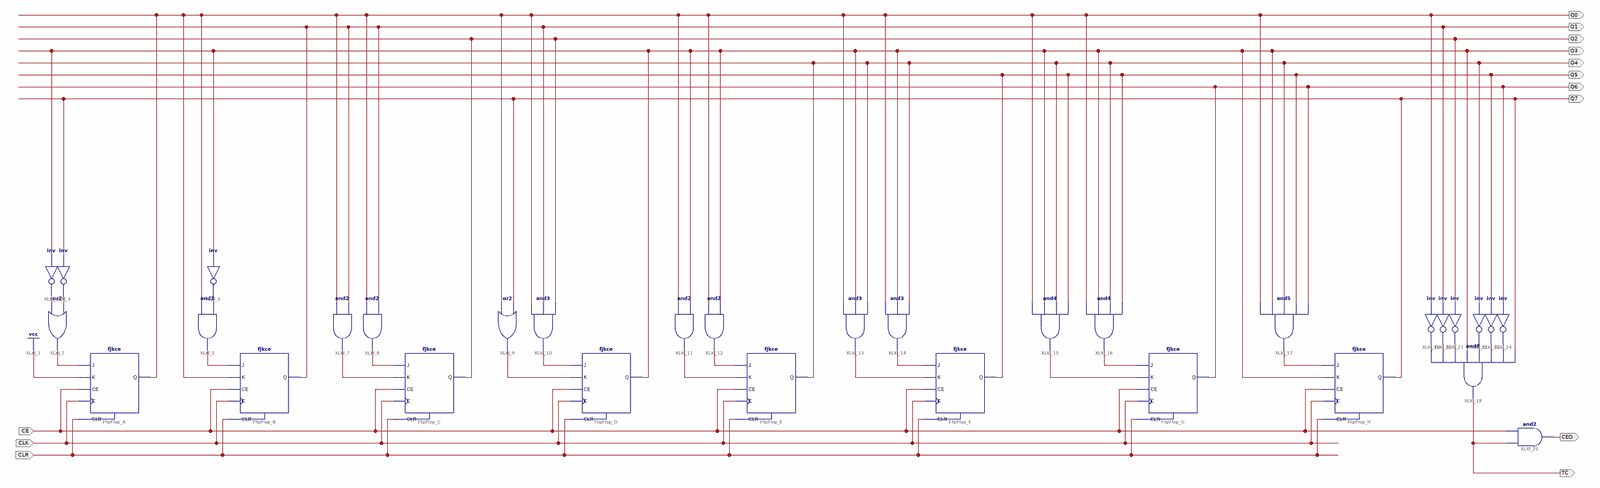
[diagram p0: schematic sheet 1, whole]
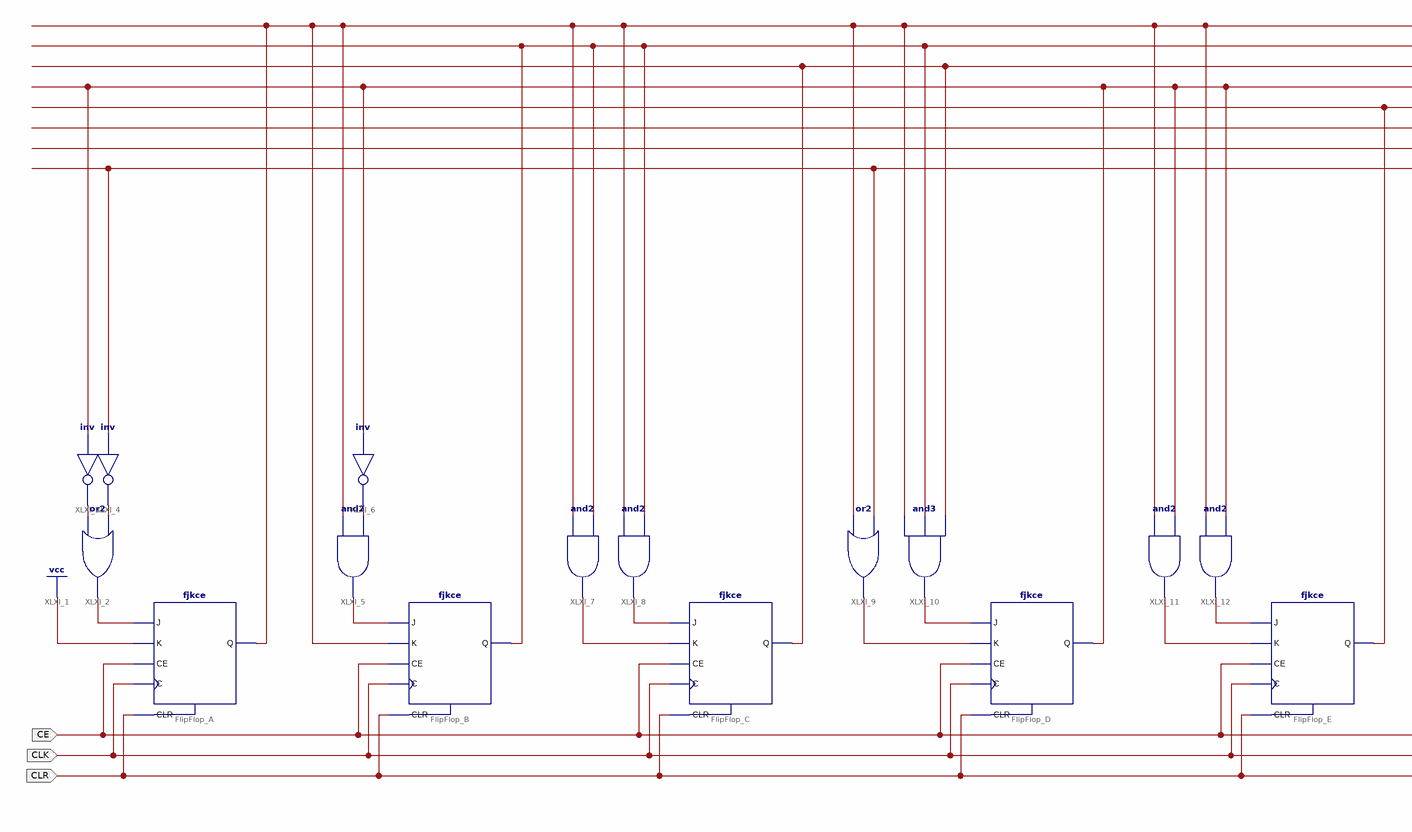
[diagram p1: schematic sheet 1, left part]
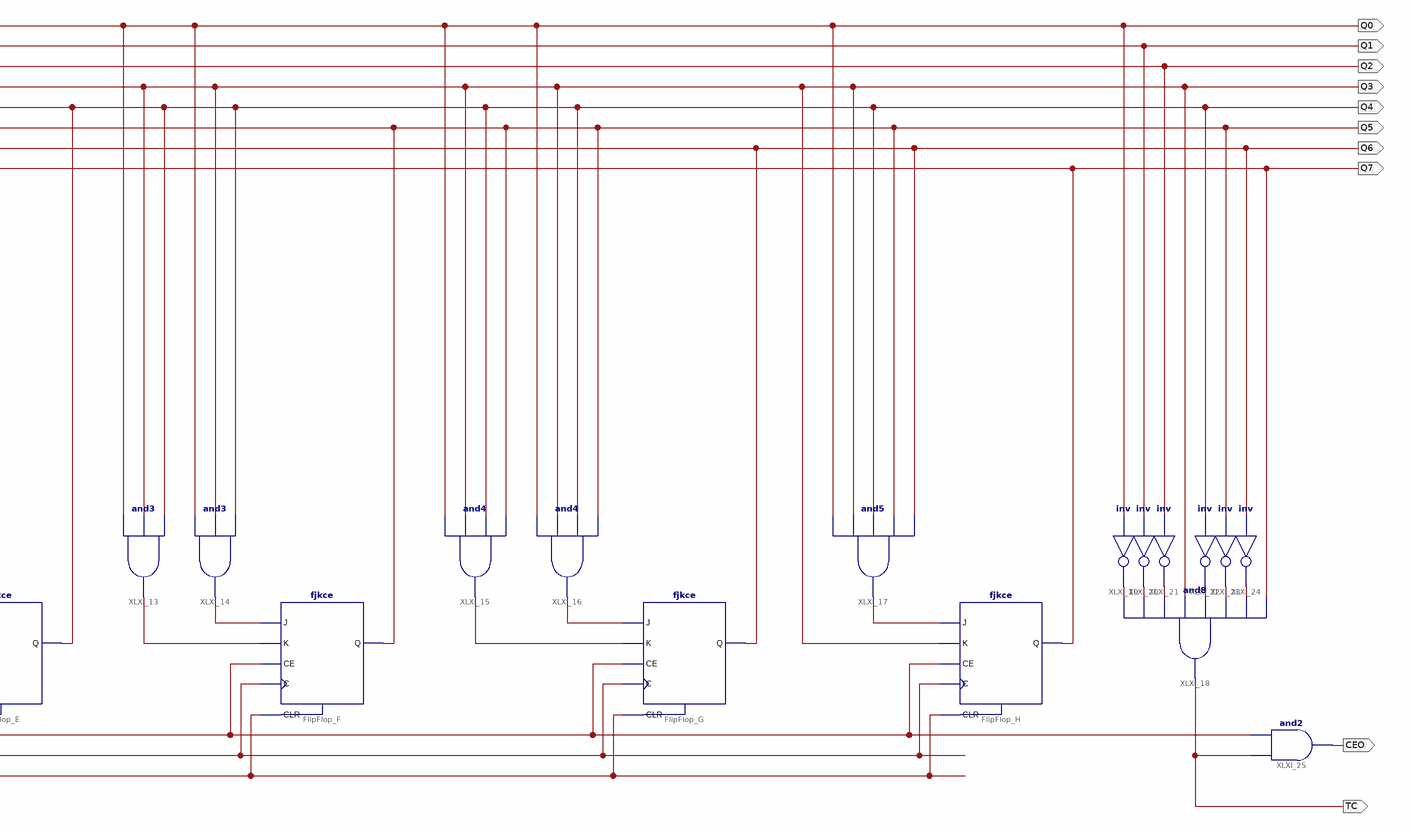
[diagram p2: schematic sheet 1, right part]
// Xilinx ISE schematic counter88.sch (spartan6) as structural Verilog: 32 symbols, 13 ports
module counter88 (
  input  CE,
  input  CLK,
  input  CLR,
  output CEO,
  output TC,
  output Q0,
  output Q1,
  output Q2,
  output Q3,
  output Q4,
  output Q5,
  output Q6,
  output Q7
);

  wire XLXN_2, XLXN_3, XLXN_4, XLXN_5, XLXN_6, XLXN_7, XLXN_8, XLXN_9, XLXN_10, XLXN_11, XLXN_12, XLXN_13,
       XLXN_14, XLXN_15, XLXN_16, XLXN_17, XLXN_18, XLXN_19, XLXN_20, XLXN_21, XLXN_22, XLXN_23;

  or XLXI_2 (XLXN_2, XLXN_3, XLXN_4);
  not XLXI_3 (XLXN_3, Q3);
  not XLXI_4 (XLXN_4, Q7);
  fjkce FlipFlop_A (.C(CLK), .CE(CE), .CLR(CLR), .J(XLXN_2), .K(1'b1), .Q(Q0));
  and XLXI_5 (XLXN_5, Q0, XLXN_6);
  not XLXI_6 (XLXN_6, Q3);
  fjkce FlipFlop_B (.C(CLK), .CE(CE), .CLR(CLR), .J(XLXN_5), .K(Q0), .Q(Q1));
  and XLXI_7 (XLXN_7, Q0, Q1);
  and XLXI_8 (XLXN_8, Q0, Q1);
  fjkce FlipFlop_C (.C(CLK), .CE(CE), .CLR(CLR), .J(XLXN_8), .K(XLXN_7), .Q(Q2));
  or XLXI_9 (XLXN_9, Q0, Q7);
  and XLXI_10 (XLXN_10, Q0, Q1, Q2);
  fjkce FlipFlop_D (.C(CLK), .CE(CE), .CLR(CLR), .J(XLXN_10), .K(XLXN_9), .Q(Q3));
  and XLXI_11 (XLXN_11, Q0, Q3);
  and XLXI_12 (XLXN_12, Q0, Q3);
  fjkce FlipFlop_E (.C(CLK), .CE(CE), .CLR(CLR), .J(XLXN_12), .K(XLXN_11), .Q(Q4));
  and XLXI_13 (XLXN_13, Q0, Q3, Q4);
  and XLXI_14 (XLXN_14, Q0, Q3, Q4);
  fjkce FlipFlop_F (.C(CLK), .CE(CE), .CLR(CLR), .J(XLXN_14), .K(XLXN_13), .Q(Q5));
  and XLXI_15 (XLXN_15, Q0, Q3, Q4, Q5);
  and XLXI_16 (XLXN_16, Q0, Q3, Q4, Q5);
  fjkce FlipFlop_G (.C(CLK), .CE(CE), .CLR(CLR), .J(XLXN_16), .K(XLXN_15), .Q(Q6));
  and XLXI_17 (XLXN_17, Q0, Q3, Q4, Q5, Q6);
  fjkce FlipFlop_H (.C(CLK), .CE(CE), .CLR(CLR), .J(XLXN_17), .K(Q3), .Q(Q7));
  and XLXI_18 (TC, XLXN_18, XLXN_19, XLXN_20, Q3, XLXN_21, XLXN_22, XLXN_23, Q7);
  not XLXI_19 (XLXN_18, Q0);
  not XLXI_20 (XLXN_19, Q1);
  not XLXI_21 (XLXN_20, Q2);
  not XLXI_22 (XLXN_21, Q4);
  not XLXI_23 (XLXN_22, Q5);
  not XLXI_24 (XLXN_23, Q6);
  and XLXI_25 (CEO, CE, TC);
endmodule
